# Altium schematic sheet Digital_ IO.SchDoc
size 431 x 279 mm; Organization: ORGANIZATION; Address1: ADDRESS 1; Address2: ADDRESS 2; Address3: ADDRESS 3; Address4: ADDRESS 4; Revision: -; SheetNumber: 3; SheetTotal: 5; ENG_APP_DATE: --/--/--; DSN_APP_DATE: --/--/--; CHK_APP_DATE: --/--/--
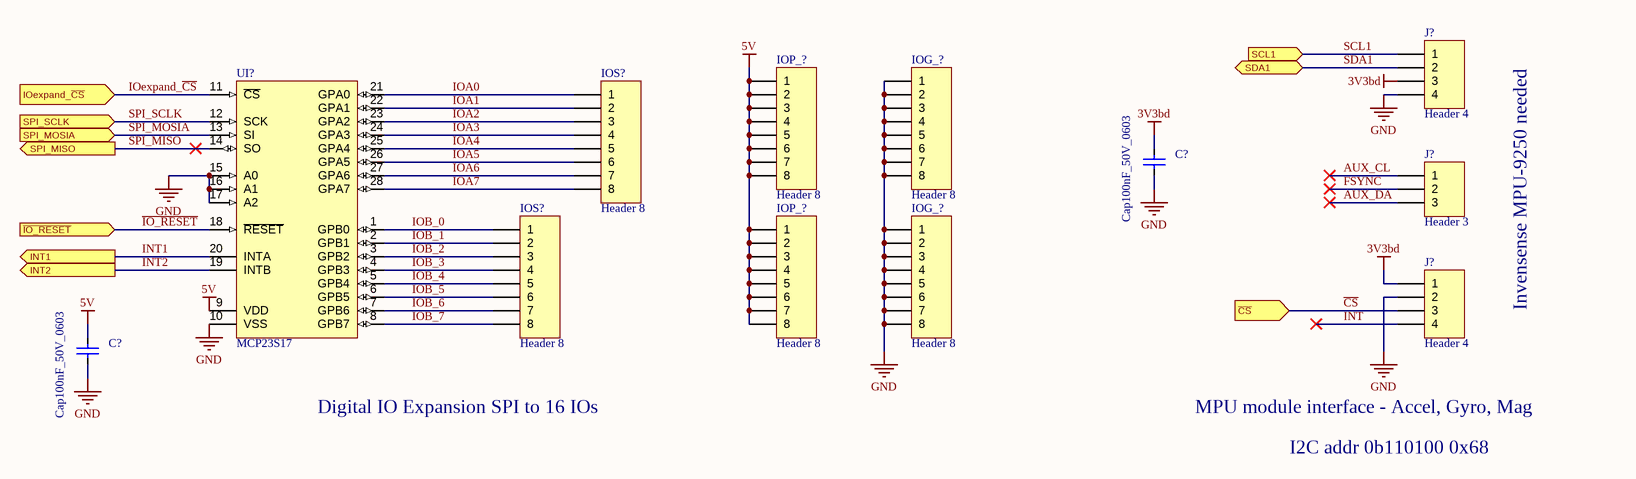
[diagram p0: Digital_ IO.SchDoc]

## Parts
(Parts that share a designator on the sheet are numbered #1, #2 ... from top to bottom, then left to right.)
C?#1  Cap100nF_50V_0603  [0603C_L]
C?#2  Cap100nF_50V_0603  [0603C_L]
IOG_?#1  Header 8  [HDR1X8]
IOG_?#2  Header 8  [HDR1X8]
IOP_?#1  Header 8  [HDR1X8]
IOP_?#2  Header 8  [HDR1X8]
IOS?#1  Header 8  [HDR1X8]
IOS?#2  Header 8  [HDR1X8]
J?#1  Header 4  [HDR1X4]
J?#2  Header 3  [HDR1X3]
J?#3  Header 4  [HDR1X4]
UI?  MCP23S17  [SOIC-SO28_L]

## Ports
INT1 (out), INT2 (out), IOexpand_~{CS} (in), SCL1 (in), SDA1 (bidir), SPI_MISO (out), SPI_MOSIA (in), SPI_SCLK (in), ~{CS} (in), ~{IO_RESET} (in)

## Nets
3V3bd: C?#1.2 J?#1.3 J?#3.1
5V: C?#2.2 IOP_?#1.1 IOP_?#1.2 IOP_?#1.3 IOP_?#1.4 IOP_?#1.5 IOP_?#1.6 IOP_?#1.7 IOP_?#1.8 IOP_?#2.1 IOP_?#2.2 IOP_?#2.3 IOP_?#2.4 IOP_?#2.5 IOP_?#2.6 IOP_?#2.7 IOP_?#2.8 UI?.9(VDD)
GND: C?#1.1 C?#2.1 IOG_?#1.1 IOG_?#1.2 IOG_?#1.3 IOG_?#1.4 IOG_?#1.5 IOG_?#1.6 IOG_?#1.7 IOG_?#1.8 IOG_?#2.1 IOG_?#2.2 IOG_?#2.3 IOG_?#2.4 IOG_?#2.5 IOG_?#2.6 IOG_?#2.7 IOG_?#2.8 J?#1.4 J?#3.2 UI?.10(VSS) UI?.15(A0) UI?.16(A1) UI?.17(A2)
~{IO_RESET}: UI?.18(~{RESET}) ; port ~{IO_RESET}
AUX_CL: J?#2.1
AUX_DA: J?#2.3
~{CS}: J?#3.3 ; port ~{CS}
FSYNC: J?#2.2
INT: J?#3.4
INT1: UI?.20(INTA) ; port INT1
INT2: UI?.19(INTB) ; port INT2
IOA0: IOS?#1.1 UI?.21(GPA0)
IOA1: IOS?#1.2 UI?.22(GPA1)
IOA2: IOS?#1.3 UI?.23(GPA2)
IOA3: IOS?#1.4 UI?.24(GPA3)
IOA4: IOS?#1.5 UI?.25(GPA4)
IOA5: IOS?#1.6 UI?.26(GPA5)
IOA6: IOS?#1.7 UI?.27(GPA6)
IOA7: IOS?#1.8 UI?.28(GPA7)
IOB_0: IOS?#2.1 UI?.1(GPB0)
IOB_1: IOS?#2.2 UI?.2(GPB1)
IOB_2: IOS?#2.3 UI?.3(GPB2)
IOB_3: IOS?#2.4 UI?.4(GPB3)
IOB_4: IOS?#2.5 UI?.5(GPB4)
IOB_5: IOS?#2.6 UI?.6(GPB5)
IOB_6: IOS?#2.7 UI?.7(GPB6)
IOB_7: IOS?#2.8 UI?.8(GPB7)
IOexpand_~{CS}: UI?.11(~{CS}) ; port IOexpand_~{CS}
SCL1: J?#1.1 ; port SCL1
SDA1: J?#1.2 ; port SDA1
SPI_MISO: UI?.14(SO) ; port SPI_MISO
SPI_MOSIA: UI?.13(SI) ; port SPI_MOSIA
SPI_SCLK: UI?.12(SCK) ; port SPI_SCLK

## Notes on the sheet
- Invensense MPU-9250 needed
- Digital IO Expansion SPI to 16 IOs
- MPU module interface - Accel, Gyro, Mag
- I2C addr 0b110100 0x68
- DWG. NO.
- REV.
- SHT.
- THIS DOCUMENT AND THE DATA DISCLOSED HEREIN OR HEREWITH IS THE PROPERTY OF ALTIUM LIMITED AND MAY BE FREELY DISTRIBUTED IN WHOLE. NO RIGHTS ARE RESERVED OR EXPRESS OR IMPLIED WARANTEE GIVEN.
- REVISION
- DESCRIPTION
- DATE
- APPROVED
- ENG:
- DSN:
- APPROVALS
- PROJECT REVISION:
- www.altium.com <http://www.altium.com>
- DOCUMENT REVISION:
- 92037, La Jolla
- USA
- Altium Ltd.
- 4225 Executive Square
- CHK:
- REFERENCE DOCUMENTS
- DESIGN ITEM:
- TITLE
- VARIANT
- BOM:
- FAB DWG:
- PCB DWG:
- ASSY DWG:
- SCALE:
- SIZE
- B
- CAGE CODE
- FILE NAME
- DWG NO.
- SHEET
- OF
- REV

## Library data of the parts
C?#1 C?#2 = CMP-00119-2: Ceramic Capacitor, Multilayer, Ceramic, 50V, 80% +Tol, 20% -Tol, Y5V, -82/+22% TC, 0.1uF, Surface Mount, 0603; Value: 100nF; Multilayer: Yes; Packaging: Tape and Reel; Case/Package: 0603; Dielectric Material: Ceramic; Height: 0.8mm; Length: 1.6mm; Max Operating Temperature: 85°C; Min Operating Temperature: -30°C; Mounting Technology: Surface Mount; Pins: 2; RoHS Compliant: Yes; Termination: Wraparound; Voltage Rating: 50V; Width: 0.8mm; Capacitor Type: Ceramic; JESD-609 Code: e3; Package Shape: Rectangular; Package Style: SMTMeter; Rated DC Voltage (URdc): 50V; Reach SVHC Compliant: Yes; Temperature Characteristics Code: Y5V; Terminal Finish: Nickel; Tolerance  (fill in as +-): 20%; Tolerance (fill in as +-): 80%
IOG_?#1 IOG_?#2 IOP_?#1 IOP_?#2 IOS?#1 IOS?#2 = CMP-00206-1: Header, 8-Pin; LatestRevisionDate: 17-Jul-2002; LatestRevisionNote: Re-released for DXP Platform.; Publisher: Altium Limited; Design Item ID: Header 8; Source: WCT.SchLib
J?#1 J?#3 = CMP-00175-1: Header, 4-Pin; LatestRevisionDate: 17-Jul-2002; LatestRevisionNote: Re-released for DXP Platform.; Publisher: Altium Limited; Design Item ID: Header 4; Source: WCT.SchLib
J?#2 = CMP-00151-1: Header, 3-Pin; LatestRevisionDate: 17-Jul-2002; LatestRevisionNote: Re-released for DXP Platform.; Publisher: Altium Limited; Design Item ID: Header 3; Source: WCT.SchLib
UI? = CMP-00187-1: 16-Bit I/O Expander with Serial Interface, 28-Pin SOIC, Extended Temperature, Tape and Reel; Manufacturer: Microchip; Manufacturer Part Number: MCP23S17T-E/SO; Available Preview Images: 2D; PackageDescription: 28-Lead Plastic Small Outline (SO) - Wide 7.50mm Body [SOIC]; ComponentLink1URL: http://www.microchip.com/; Code_JEDEC: MS-013; ComponentLink3URL: http://www.microchip.com/stellent/groups/techpub_sg/documents/packagingspec/en012702.pdf; DatasheetVersion: revB, Feb-2007; ComponentLink2URL: http://ww1.microchip.com/downloads/en/DeviceDoc/21952b.pdf; ComponentLink2Description: Datasheet; ComponentLink3Description: Package Specification; PackageReference: SOIC-SO28; RevisionNote: URLs added. Sch pin type corrected.; ComponentLink1Description: Manufacturer URL; PackageVersion: revBB, Aug-2009; Design Item ID: MCP23S17T-E/SO; Source: WCT.SchLib